# EAGLE design power_supply_1iter (EAGLE 9.6.2)
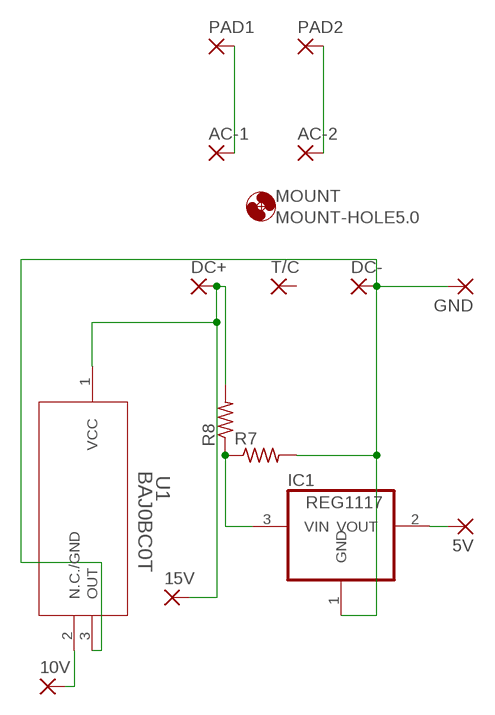
[diagram p0: schematic, sheet 1]

## Parts
5V  3,17/1,1  [3,17/1,1]
10V  3,17/1,1  [3,17/1,1]
15V  3,17/1,1  [3,17/1,1]
AC-1  3,81/1,1  [3,81/1,1]
AC-2  3,81/1,1  [3,81/1,1]
DC+  3,81/1,1  [3,81/1,1]
DC-  3,81/1,1  [3,81/1,1]
GND  3,17/1,1  [3,17/1,1]
IC1  REG1117  [SOT223_HEATSINK]
MOUNT  MOUNT-HOLE5.0  [5,0]
PAD1  WIREPAD4,16O1,6  [4,16O1,6]
PAD2  WIREPAD4,16O1,6  [4,16O1,6]
R7  R-US_0309/12  [0309/12]
R8  R-US_0309/12  [0309/12]
T/C  3,81/1,1  [3,81/1,1]
U1  BAJ0BC0T  [TO220FP-3_ROM]

## Nets
N$1: AC-1.1(P) PAD1.1(P)
N$2: AC-2.1(P) PAD2.1(P)
N$3: 15V.1(P) DC+.1(P) R8.2 U1.1(VCC)
N$4: DC-.1(P) GND.1(P) IC1.1(GND) R7.2 U1.3(OUT)
N$5: IC1.3(VIN) R7.1 R8.1
N$6: 10V.1(P) U1.2(N.C./GND)
N$7: 5V.1(P) IC1.2(VOUT)
Unconnected: T/C.1(P)

## Library data of the parts
5V 10V 15V GND = wirepad:3,17/1,1: THROUGH-HOLE PAD
AC-1 AC-2 DC+ DC- T/C = wirepad:3,81/1,1: THROUGH-HOLE PAD
IC1 = burr-brown-3:REG1117: 800mA and 1A Low Dropout (LDO) Positive Regulator 1.8V, 2.5V, 2.85V, 3.3V, 5V, and Adj
MOUNT = holes:MOUNT-HOLE: MOUNTING HOLE with drill center marker
PAD1 PAD2 = wirepad:WIREPAD: Wire PAD connect wire on PCB
R7 R8 = rcl:R-US_: RESISTOR, American symbol; SPICEPREFIX: R
U1 = scipt_lib:BAJ0BC0T; BUILT_BY: EMA_Molly; COPYRIGHT: Copyright (C) 2018 Accelerated Designs. All rights reserved; MANUFACTURER_PART_NUMBER: BAJ0BC0T; SOURCELIBRARY: ROHM_2019-10-21; VENDOR: ROHM Semiconductor

## Board
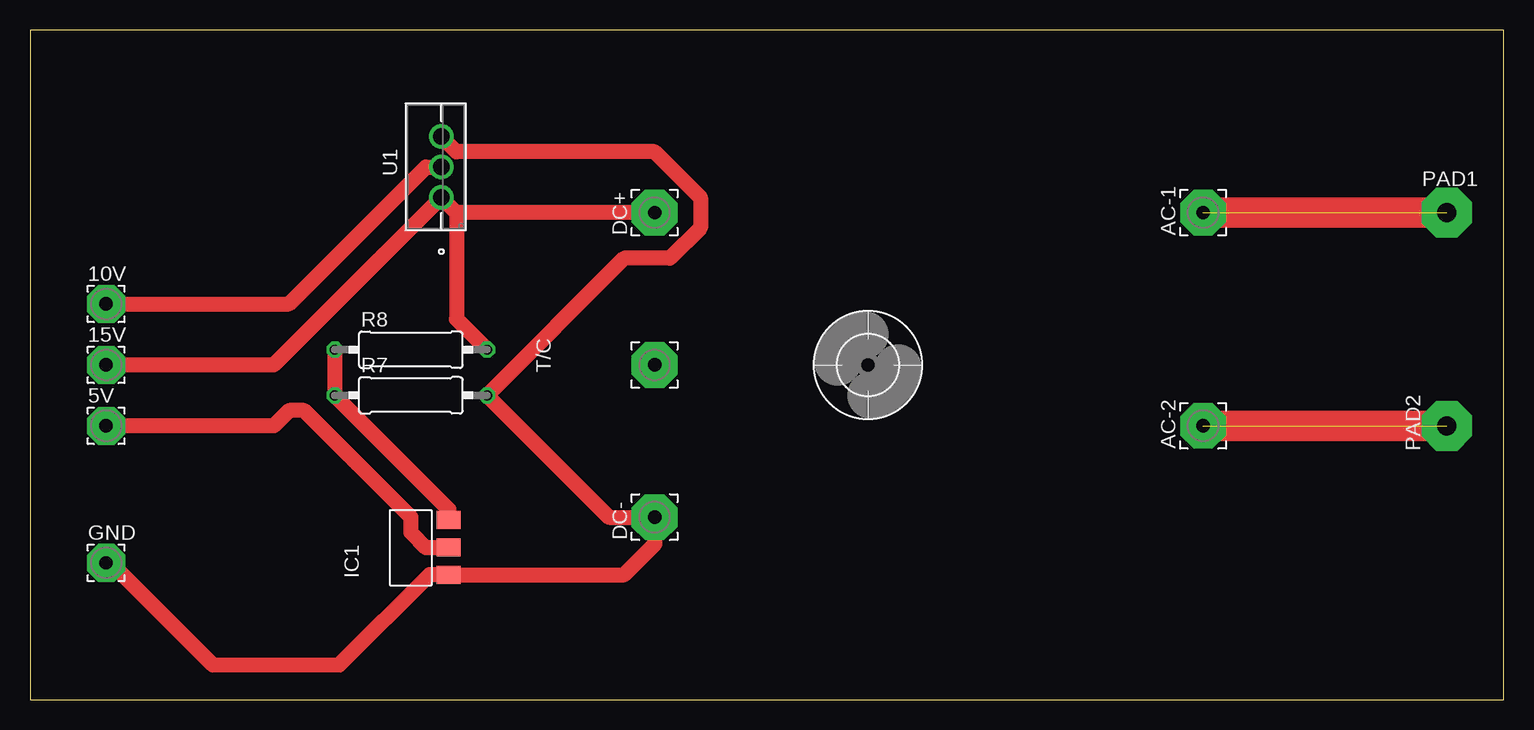
[diagram p1: board, top side]

Size 122.86 x 55.87 mm. Coordinates in mm from the lower left corner, seen from the top.
Outline: 0,0 122.86,0 122.86,55.87 0,55.87 0,0
Copper layers (1*16): Top 0.035mm / dielectric 1.5mm / Bottom 0.035mm
Design rules "default": minimum track width 6mil, minimum drill 0.35mm, track to track 6mil, track to pad 6mil, pad to pad 6mil, via to via 6mil, smd to smd 6mil, copper to edge 40mil, drill to drill 6mil, minimum pad ring 10mil, minimum via ring 8mil, stop-mask expansion 4mil, vias tented up to drill 0mil, thermal gap 10mil

### Footprints (pad centres in the part's own frame; a part is rotated, then mirrored left to right if it is on the bottom)
3,17/1,1 = drill 1.118 pad 3.175 octagon: 1 0,0
3,81/1,1 = drill 1.118 pad 3.81 octagon: 1 0,0
SOT223_HEATSINK = smd 1.499 x 2.007: 1 -2.261,-3.15; 2 0.025,-3.15; 3 2.311,-3.15
5,0 = hole 5: 0,0
4,16O1,6 = drill 1.6 pad 4.166 octagon: 1 0,0
0309/12 = drill 0.813 octagon: 1 -6.35,0; 2 6.35,0
TO220FP-3_ROM = drill 1.372 pad 1.88: 1 0,0; 2 2.54,0; 3 5.08,0

### Placement (x,y rotation side)
5V  6.35,22.86 0 top
10V  6.35,33.02 0 top
15V  6.35,27.94 0 top
AC-1  97.79,40.64 90 top
AC-2  97.79,22.86 90 top
DC+  52.07,40.64 90 top
DC-  52.07,15.24 90 top
GND  6.35,11.43 0 top
IC1  31.75,12.7 90 top
MOUNT  69.85,27.94 90 top
PAD1  118.11,40.64 0 top
PAD2  118.11,22.86 90 top
R7  31.75,25.4 0 top
R8  31.75,29.21 0 top
T/C  52.07,27.94 90 top
U1  34.29,41.91 90 top

### Tracks (layer width: path | path; a pad name or v marks a point on that pad's centre or on a via)
N$1  (1 unrouted)
  Top 2.54: AC-1.1 PAD1.1
N$2  (1 unrouted)
  Top 2.54: AC-2.1 PAD2.1
N$3
  Top 1.27: DC+.1 35.56,40.64 | 35.56,40.64 U1.1 20.32,27.94 15V.1 | 35.56,40.64 35.56,31.75 R8.2
N$4
  Top 1.27: GND.1 6.73,11.43 15.24,2.92 25.78,2.92 33.3,10.44 IC1.1 49.53,10.44 52.07,12.98 DC-.1 48.26,15.24 R7.2 49.53,36.83 53.34,36.83 55.88,39.37 55.88,41.91 52.07,45.72 35.56,45.72 U1.3
N$5
  Top 1.27: R8.1 R7.1 34.9,15.9 IC1.3
N$6
  Top 1.27: U1.2 33.02,44.45 21.59,33.02 10V.1
N$7
  Top 1.27: IC1.2 34.87,12.7 33.02,12.7 31.75,13.97 31.75,15.24 22.86,24.13 21.59,24.13 20.32,22.86 5V.1